# Altium schematic sheet CS4270_Audio_Codec.SchDoc
size A
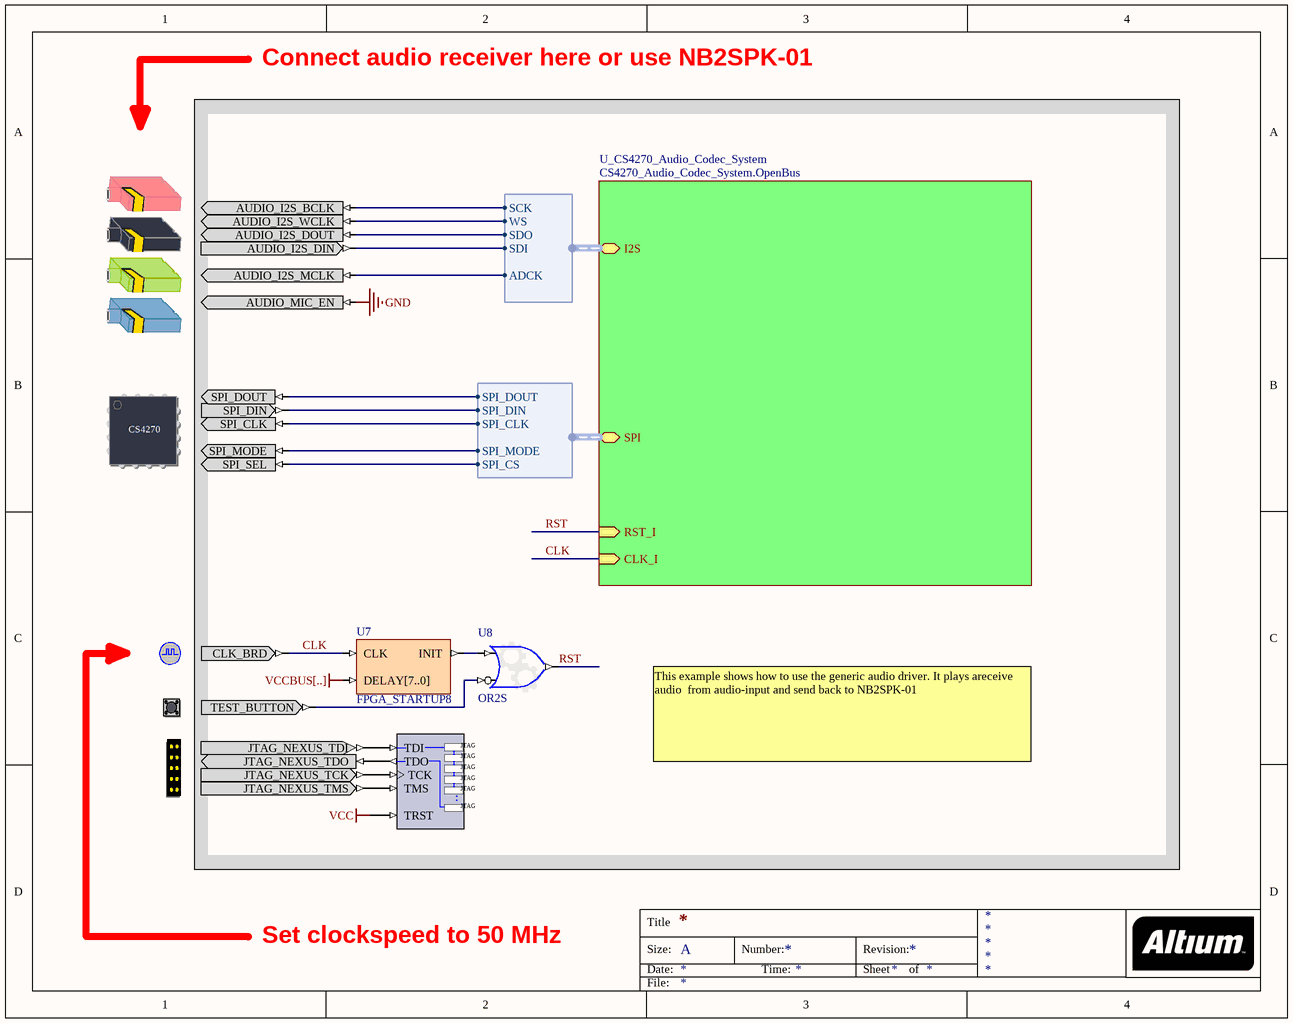
[diagram p0: CS4270_Audio_Codec.SchDoc]

## Parts
(Parts that share a designator on the sheet are numbered #1, #2 ... from top to bottom, then left to right.)
?#1  AUDIO_CODEC  (value not drawn)
?#2  CLOCK_BOARD  (value not drawn)
?#3  TEST_BUTTON  (value not drawn)
?#4  NEXUS_JTAG_CONNECTOR  (value not drawn)
CS4270  AUDIO_CODEC_CTRL  (value not drawn)
NEXUS_JTAG_PORT  NEXUS_JTAG_PORT  (value not drawn)
U7  FPGA_STARTUP8
U8  OR2S

## Sub-sheets
U_CS4270_Audio_Codec_System = CS4270_Audio_Codec_System.OpenBus: I2S (harness I2S_W_Both), RST_I (in), CLK_I (in), SPI (harness SPI_W)

## Harnesses
I2S_W_Both: SCK, WS, SDO, SDI, ADCK
SPI_W: SPI_DOUT, SPI_DIN, SPI_CLK, SPI_MODE, SPI_CS

## Nets
GND: ?#1.AUDIO_MIC_EN
VCC: NEXUS_JTAG_PORT.TRST
VCCBUS[..]: U7.DELAY[7..0]
CLK: ?#2.CLK_BRD U7.CLK ; sheet U_CS4270_Audio_Codec_System/CLK_I
RST: U8.O ; sheet U_CS4270_Audio_Codec_System/RST_I
Net?#1_AUDIO_I2S_BCLK: ?#1.AUDIO_I2S_BCLK ; sheet U_CS4270_Audio_Codec_System/I2S.SCK
Net?#1_AUDIO_I2S_DIN: ?#1.AUDIO_I2S_DIN ; sheet U_CS4270_Audio_Codec_System/I2S.SDI
Net?#1_AUDIO_I2S_DOUT: ?#1.AUDIO_I2S_DOUT ; sheet U_CS4270_Audio_Codec_System/I2S.SDO
Net?#1_AUDIO_I2S_MCLK: ?#1.AUDIO_I2S_MCLK ; sheet U_CS4270_Audio_Codec_System/I2S.ADCK
Net?#1_AUDIO_I2S_WCLK: ?#1.AUDIO_I2S_WCLK ; sheet U_CS4270_Audio_Codec_System/I2S.WS
Net?#3_TEST_BUTTON: ?#3.TEST_BUTTON U8.I1
Net?#4_JTAG_NEXUS_TCK: ?#4.JTAG_NEXUS_TCK NEXUS_JTAG_PORT.TCK
Net?#4_JTAG_NEXUS_TDI: ?#4.JTAG_NEXUS_TDI NEXUS_JTAG_PORT.TDI
Net?#4_JTAG_NEXUS_TDO: ?#4.JTAG_NEXUS_TDO NEXUS_JTAG_PORT.TDO
Net?#4_JTAG_NEXUS_TMS: ?#4.JTAG_NEXUS_TMS NEXUS_JTAG_PORT.TMS
NetCS4270_SPI_CLK: CS4270.SPI_CLK ; sheet U_CS4270_Audio_Codec_System/SPI.SPI_CLK
NetCS4270_SPI_DIN: CS4270.SPI_DIN ; sheet U_CS4270_Audio_Codec_System/SPI.SPI_DIN
NetCS4270_SPI_DOUT: CS4270.SPI_DOUT ; sheet U_CS4270_Audio_Codec_System/SPI.SPI_DOUT
NetCS4270_SPI_MODE: CS4270.SPI_MODE ; sheet U_CS4270_Audio_Codec_System/SPI.SPI_MODE
NetCS4270_SPI_SEL: CS4270.SPI_SEL ; sheet U_CS4270_Audio_Codec_System/SPI.SPI_CS
NetU7_INIT: U7.INIT U8.I0

## Notes on the sheet
- Connect audio receiver here or use NB2SPK-01
- This example shows how to use the generic audio driver. It plays areceive audio  from audio-input and send back to NB2SPK-01
- Set clockspeed to 50 MHz
- Title
- Size:
- Date:
- A
- Number:
- Time:
- Revision:
- Sheet
- of
- File:
- (in symbol NEXUS_JTAG_PORT) .

## Library data of the parts
?#1 = AUDIO_CODEC: Audio Codec; PortComponent: True; Published: 22-Jan-2007; Publisher: Altium Limited; HelpURL: TR0145 Technical Reference for Altium's Audio-Video Peripheral Board PB01.pdf#page=12
?#2 = CLOCK_BOARD: Global System Clock Supply; PortComponent: True; Published: 19-Nov-2003; Publisher: Altium Limited; HelpURL: TR0143 Technical Reference Manual for Altium's Desktop NanoBoard NB2DSK01.pdf#page=41; UseInDSF: True
?#3 = TEST_BUTTON: Test / Reset Button; PortComponent: True; Published: 19-Nov-2003; Publisher: Altium Limited; HelpURL: TR0143 Technical Reference Manual for Altium's Desktop NanoBoard NB2DSK01.pdf#page=53
?#4 = NEXUS_JTAG_CONNECTOR: JTAG Port; PortComponent: True; Published: 19-Nov-2003; Publisher: Altium Limited; HelpURL: TR0102 NanoBoard Technical Reference Manual - NB1.pdf#page=33
CS4270 = AUDIO_CODEC_CTRL: Audio Codec Control; PortComponent: True; Published: 22-Jan-2007; Publisher: Altium Limited; HelpURL: TR0145 Technical Reference for Altium's Audio-Video Peripheral Board PB01.pdf#page=13
NEXUS_JTAG_PORT = NEXUS_JTAG_PORT: Soft Nexus-Chain Connector; NEXUS_JTAG_CONNECTOR: True; FunctionalClass: JTAG; Published: 29-Jan-2004; Publisher: Altium Limited; LastRevisionNo: 1.00.00; HelpURL: CR0118 FPGA Generic Library Guide.pdf#page=405
U7 = FPGA_STARTUP8: FPGA Startup With 8 Bit Delay; Published: 9-Dec-2004; Publisher: Altium Limited; HelpURL: CR0119 FPGA_STARTUPx Powerup Delay Unit.pdf; LastRevisionNo: 1.00.00; ComponentLink1Description: Core &Resource Usage; ComponentLink1URL: CR0139 FPGA Peripheral Resource Usage.pdf#page=11
U8 = GATE: Configurable Generic Gate; ConfiguratorName: GENERIC_GATE; ConfigurationParameters: {}Version[1.0]{}GateKind[OR]{}BusInput[False]{}GateInputType[Bit]{}GateOutputOption[Normal]{}BusWidth[8]{}RegisterOutputs[False]{}NegativeClockEdge[False]{}InputCount[2]{}InputInvert0[False]{}InputInvert1[True]{}; LastRevisionNo: 1.00.00; Published: 3-Sep-2008; Publisher: Altium Limited